# Altium schematic sheet SDRAM RV1126B.SchDoc: LPDDR4 of CPU
size A3; DrawnBy: ThanhQuoc; Revision: V01; SheetNumber: 7; SheetTotal: 21; Project: RV1126 CAMERA BOARD DESIGN
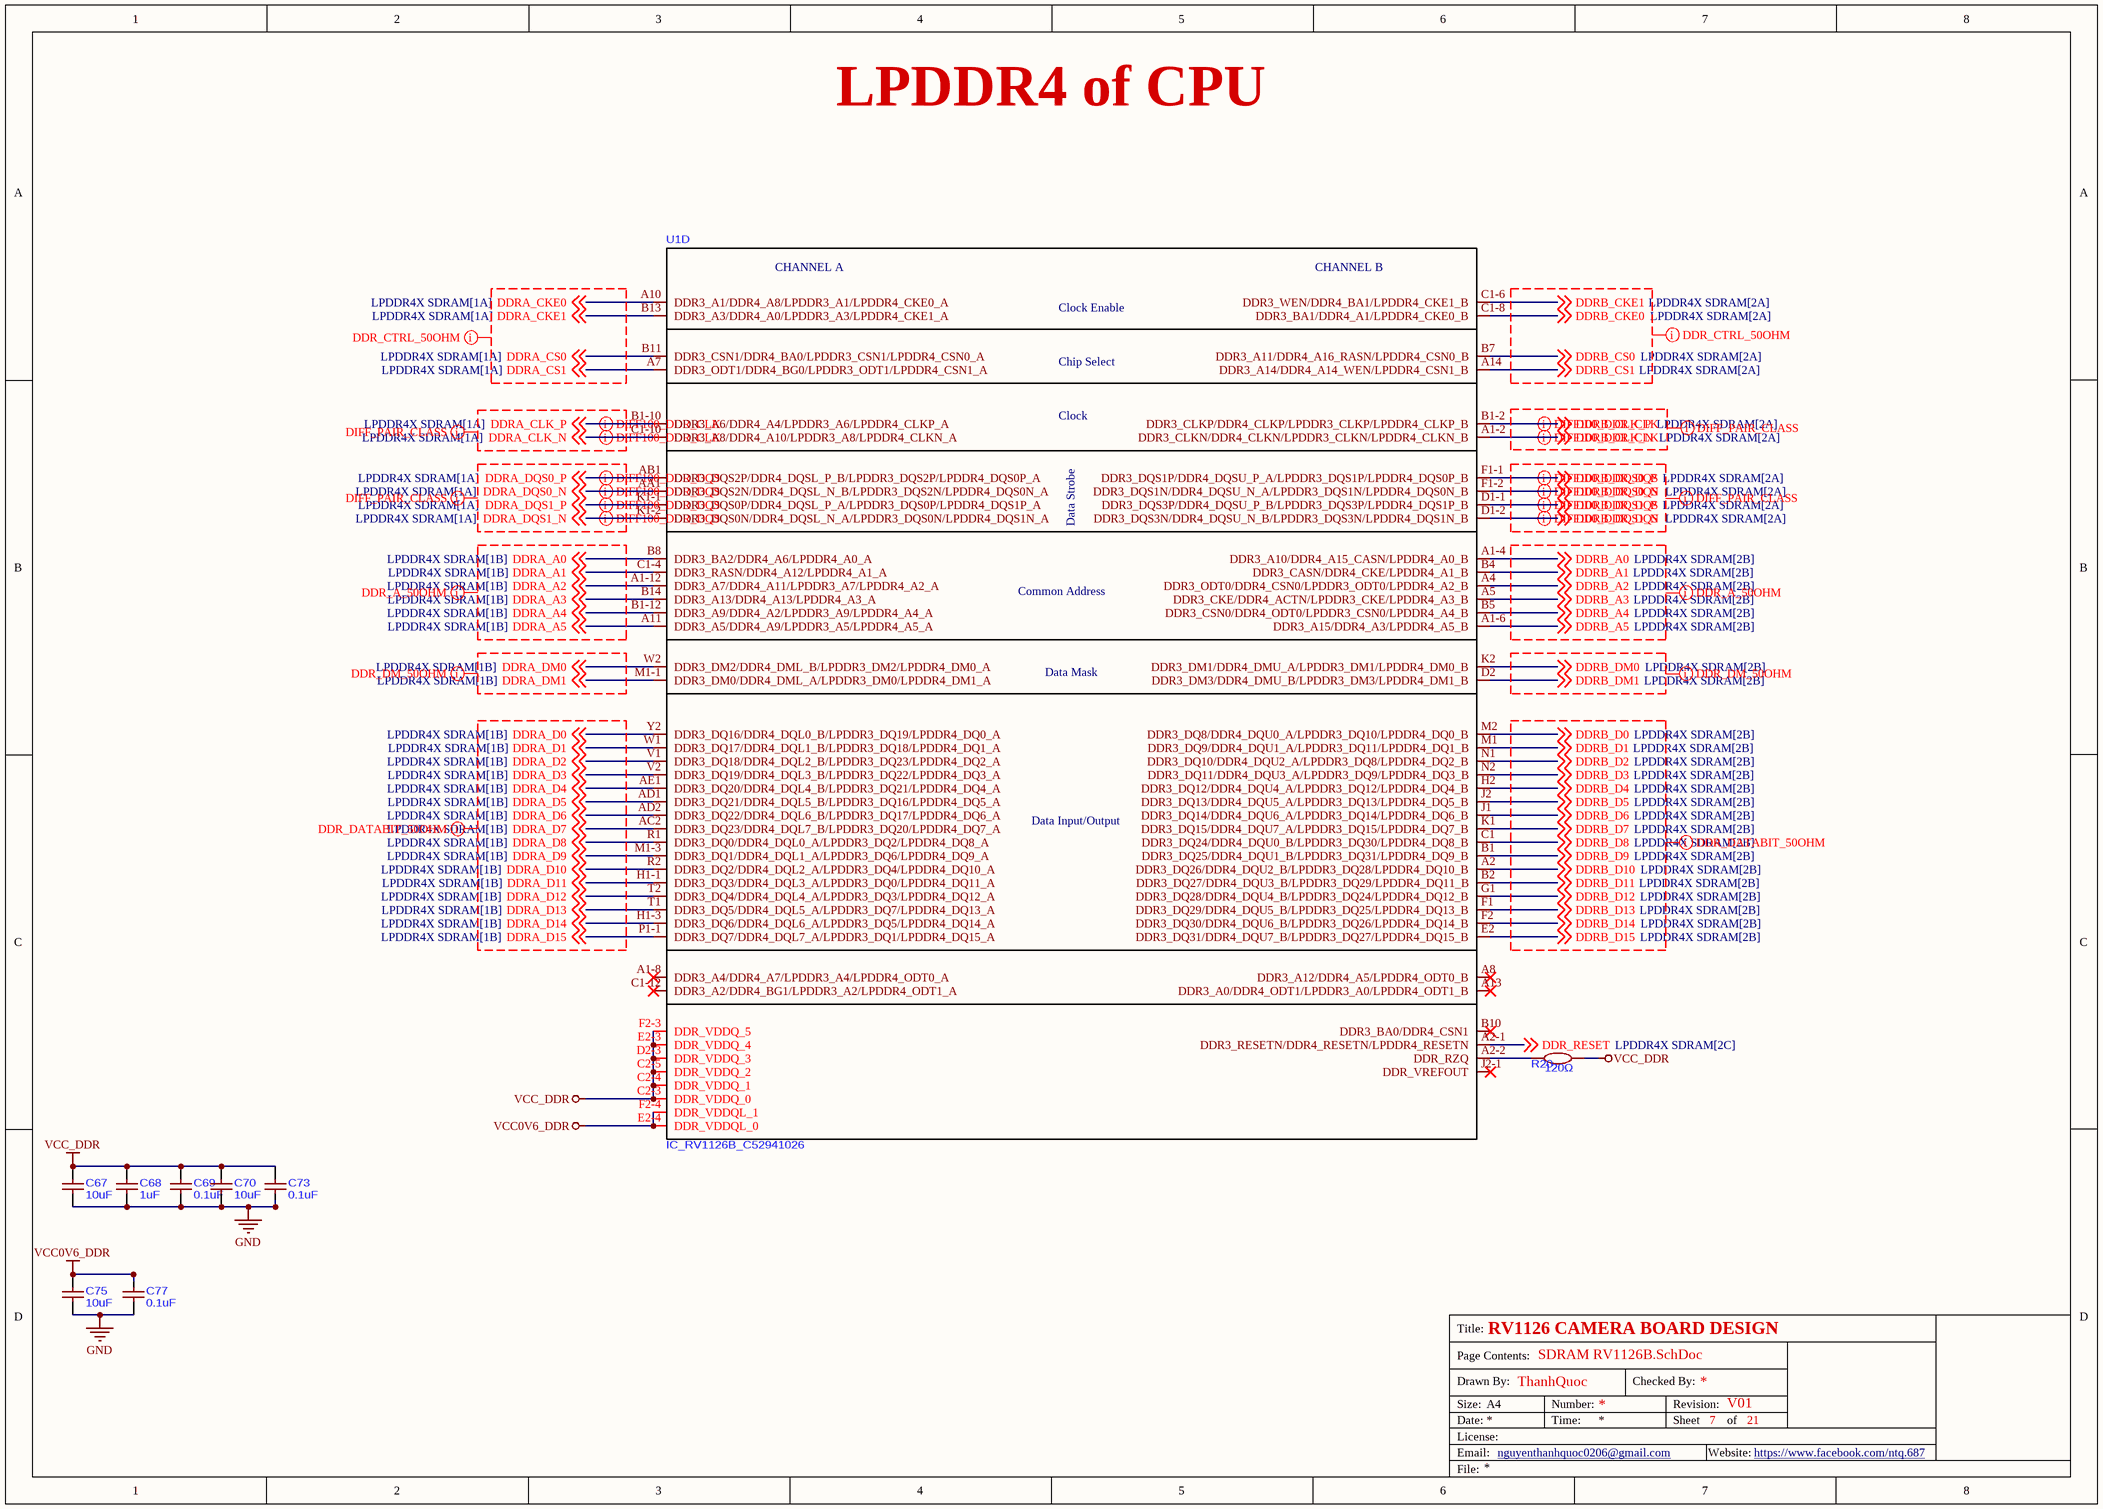
[diagram p0: SDRAM RV1126B.SchDoc]

## Parts
C67  10uF  [C0402]
C68  1uF  [C0201]
C69  0.1uF  [C0201]
C70  10uF  [C0402]
C73  0.1uF  [C0201]
C75  10uF  [C0402]
C77  0.1uF  [C0201]
R20  120Ω  [R0201]
U1  IC_RV1126B_C52941026  [CCSP-491_L14.0-W14.0-TL_RV1126B]  (part D of 18)

## Nets
GND: C67.1 C68.1 C69.1 C70.1 C73.1 C75.1 C77.1
VCC0V6_DDR: C75.2 C77.2 U1.E2-4(DDR_VDDQL_0) U1.F2-4(DDR_VDDQL_1)
VCC_DDR: C67.2 C68.2 C69.2 C70.2 C73.2 R20.1 U1.C2-3(DDR_VDDQ_0) U1.C2-4(DDR_VDDQ_1) U1.C2-5(DDR_VDDQ_2) U1.D2-3(DDR_VDDQ_3) U1.E2-3(DDR_VDDQ_4) U1.F2-3(DDR_VDDQ_5)
DDR_RESET: U1.A2-1(DDR3_RESETN/DDR4_RESETN/LPDDR4_RESETN) ; off-sheet DDR_RESET
DDRA_A0: U1.B8(DDR3_BA2/DDR4_A6/LPDDR4_A0_A) ; off-sheet DDRA_A0
DDRA_A1: U1.C1-4(DDR3_RASN/DDR4_A12/LPDDR4_A1_A) ; off-sheet DDRA_A1
DDRA_A2: U1.A1-12(DDR3_A7/DDR4_A11/LPDDR3_A7/LPDDR4_A2_A) ; off-sheet DDRA_A2
DDRA_A3: U1.B14(DDR3_A13/DDR4_A13/LPDDR4_A3_A) ; off-sheet DDRA_A3
DDRA_A4: U1.B1-12(DDR3_A9/DDR4_A2/LPDDR3_A9/LPDDR4_A4_A) ; off-sheet DDRA_A4
DDRA_A5: U1.A11(DDR3_A5/DDR4_A9/LPDDR3_A5/LPDDR4_A5_A) ; off-sheet DDRA_A5
DDRA_CKE0: U1.A10(DDR3_A1/DDR4_A8/LPDDR3_A1/LPDDR4_CKE0_A) ; off-sheet DDRA_CKE0
DDRA_CKE1: U1.B13(DDR3_A3/DDR4_A0/LPDDR3_A3/LPDDR4_CKE1_A) ; off-sheet DDRA_CKE1
DDRA_CLK_N: U1.C1-10(DDR3_A8/DDR4_A10/LPDDR3_A8/LPDDR4_CLKN_A) ; off-sheet DDRA_CLK_N
DDRA_CLK_P: U1.B1-10(DDR3_A6/DDR4_A4/LPDDR3_A6/LPDDR4_CLKP_A) ; off-sheet DDRA_CLK_P
DDRA_CS0: U1.B11(DDR3_CSN1/DDR4_BA0/LPDDR3_CSN1/LPDDR4_CSN0_A) ; off-sheet DDRA_CS0
DDRA_CS1: U1.A7(DDR3_ODT1/DDR4_BG0/LPDDR3_ODT1/LPDDR4_CSN1_A) ; off-sheet DDRA_CS1
DDRA_D0: U1.Y2(DDR3_DQ16/DDR4_DQL0_B/LPDDR3_DQ19/LPDDR4_DQ0_A) ; off-sheet DDRA_D0
DDRA_D1: U1.W1(DDR3_DQ17/DDR4_DQL1_B/LPDDR3_DQ18/LPDDR4_DQ1_A) ; off-sheet DDRA_D1
DDRA_D2: U1.V1(DDR3_DQ18/DDR4_DQL2_B/LPDDR3_DQ23/LPDDR4_DQ2_A) ; off-sheet DDRA_D2
DDRA_D3: U1.V2(DDR3_DQ19/DDR4_DQL3_B/LPDDR3_DQ22/LPDDR4_DQ3_A) ; off-sheet DDRA_D3
DDRA_D4: U1.AE1(DDR3_DQ20/DDR4_DQL4_B/LPDDR3_DQ21/LPDDR4_DQ4_A) ; off-sheet DDRA_D4
DDRA_D5: U1.AD1(DDR3_DQ21/DDR4_DQL5_B/LPDDR3_DQ16/LPDDR4_DQ5_A) ; off-sheet DDRA_D5
DDRA_D6: U1.AD2(DDR3_DQ22/DDR4_DQL6_B/LPDDR3_DQ17/LPDDR4_DQ6_A) ; off-sheet DDRA_D6
DDRA_D7: U1.AC2(DDR3_DQ23/DDR4_DQL7_B/LPDDR3_DQ20/LPDDR4_DQ7_A) ; off-sheet DDRA_D7
DDRA_D8: U1.R1(DDR3_DQ0/DDR4_DQL0_A/LPDDR3_DQ2/LPDDR4_DQ8_A) ; off-sheet DDRA_D8
DDRA_D9: U1.M1-3(DDR3_DQ1/DDR4_DQL1_A/LPDDR3_DQ6/LPDDR4_DQ9_A) ; off-sheet DDRA_D9
DDRA_D10: U1.R2(DDR3_DQ2/DDR4_DQL2_A/LPDDR3_DQ4/LPDDR4_DQ10_A) ; off-sheet DDRA_D10
DDRA_D11: U1.H1-1(DDR3_DQ3/DDR4_DQL3_A/LPDDR3_DQ0/LPDDR4_DQ11_A) ; off-sheet DDRA_D11
DDRA_D12: U1.T2(DDR3_DQ4/DDR4_DQL4_A/LPDDR3_DQ3/LPDDR4_DQ12_A) ; off-sheet DDRA_D12
DDRA_D13: U1.T1(DDR3_DQ5/DDR4_DQL5_A/LPDDR3_DQ7/LPDDR4_DQ13_A) ; off-sheet DDRA_D13
DDRA_D14: U1.H1-3(DDR3_DQ6/DDR4_DQL6_A/LPDDR3_DQ5/LPDDR4_DQ14_A) ; off-sheet DDRA_D14
DDRA_D15: U1.P1-1(DDR3_DQ7/DDR4_DQL7_A/LPDDR3_DQ1/LPDDR4_DQ15_A) ; off-sheet DDRA_D15
DDRA_DM0: U1.W2(DDR3_DM2/DDR4_DML_B/LPDDR3_DM2/LPDDR4_DM0_A) ; off-sheet DDRA_DM0
DDRA_DM1: U1.M1-1(DDR3_DM0/DDR4_DML_A/LPDDR3_DM0/LPDDR4_DM1_A) ; off-sheet DDRA_DM1
DDRA_DQS0_N: U1.AA1(DDR3_DQS2N/DDR4_DQSL_N_B/LPDDR3_DQS2N/LPDDR4_DQS0N_A) ; off-sheet DDRA_DQS0_N
DDRA_DQS0_P: U1.AB1(DDR3_DQS2P/DDR4_DQSL_P_B/LPDDR3_DQS2P/LPDDR4_DQS0P_A) ; off-sheet DDRA_DQS0_P
DDRA_DQS1_N: U1.K1-2(DDR3_DQS0N/DDR4_DQSL_N_A/LPDDR3_DQS0N/LPDDR4_DQS1N_A) ; off-sheet DDRA_DQS1_N
DDRA_DQS1_P: U1.K1-1(DDR3_DQS0P/DDR4_DQSL_P_A/LPDDR3_DQS0P/LPDDR4_DQS1P_A) ; off-sheet DDRA_DQS1_P
DDRB_A0: U1.A1-4(DDR3_A10/DDR4_A15_CASN/LPDDR4_A0_B) ; off-sheet DDRB_A0
DDRB_A1: U1.B4(DDR3_CASN/DDR4_CKE/LPDDR4_A1_B) ; off-sheet DDRB_A1
DDRB_A2: U1.A4(DDR3_ODT0/DDR4_CSN0/LPDDR3_ODT0/LPDDR4_A2_B) ; off-sheet DDRB_A2
DDRB_A3: U1.A5(DDR3_CKE/DDR4_ACTN/LPDDR3_CKE/LPDDR4_A3_B) ; off-sheet DDRB_A3
DDRB_A4: U1.B5(DDR3_CSN0/DDR4_ODT0/LPDDR3_CSN0/LPDDR4_A4_B) ; off-sheet DDRB_A4
DDRB_A5: U1.A1-6(DDR3_A15/DDR4_A3/LPDDR4_A5_B) ; off-sheet DDRB_A5
DDRB_CKE0: U1.C1-8(DDR3_BA1/DDR4_A1/LPDDR4_CKE0_B) ; off-sheet DDRB_CKE0
DDRB_CKE1: U1.C1-6(DDR3_WEN/DDR4_BA1/LPDDR4_CKE1_B) ; off-sheet DDRB_CKE1
DDRB_CLK_N: U1.A1-2(DDR3_CLKN/DDR4_CLKN/LPDDR3_CLKN/LPDDR4_CLKN_B) ; off-sheet DDRB_CLK_N
DDRB_CLK_P: U1.B1-2(DDR3_CLKP/DDR4_CLKP/LPDDR3_CLKP/LPDDR4_CLKP_B) ; off-sheet DDRB_CLK_P
DDRB_CS0: U1.B7(DDR3_A11/DDR4_A16_RASN/LPDDR4_CSN0_B) ; off-sheet DDRB_CS0
DDRB_CS1: U1.A14(DDR3_A14/DDR4_A14_WEN/LPDDR4_CSN1_B) ; off-sheet DDRB_CS1
DDRB_D0: U1.M2(DDR3_DQ8/DDR4_DQU0_A/LPDDR3_DQ10/LPDDR4_DQ0_B) ; off-sheet DDRB_D0
DDRB_D1: U1.M1(DDR3_DQ9/DDR4_DQU1_A/LPDDR3_DQ11/LPDDR4_DQ1_B) ; off-sheet DDRB_D1
DDRB_D2: U1.N1(DDR3_DQ10/DDR4_DQU2_A/LPDDR3_DQ8/LPDDR4_DQ2_B) ; off-sheet DDRB_D2
DDRB_D3: U1.N2(DDR3_DQ11/DDR4_DQU3_A/LPDDR3_DQ9/LPDDR4_DQ3_B) ; off-sheet DDRB_D3
DDRB_D4: U1.H2(DDR3_DQ12/DDR4_DQU4_A/LPDDR3_DQ12/LPDDR4_DQ4_B) ; off-sheet DDRB_D4
DDRB_D5: U1.J2(DDR3_DQ13/DDR4_DQU5_A/LPDDR3_DQ13/LPDDR4_DQ5_B) ; off-sheet DDRB_D5
DDRB_D6: U1.J1(DDR3_DQ14/DDR4_DQU6_A/LPDDR3_DQ14/LPDDR4_DQ6_B) ; off-sheet DDRB_D6
DDRB_D7: U1.K1(DDR3_DQ15/DDR4_DQU7_A/LPDDR3_DQ15/LPDDR4_DQ7_B) ; off-sheet DDRB_D7
DDRB_D8: U1.C1(DDR3_DQ24/DDR4_DQU0_B/LPDDR3_DQ30/LPDDR4_DQ8_B) ; off-sheet DDRB_D8
DDRB_D9: U1.B1(DDR3_DQ25/DDR4_DQU1_B/LPDDR3_DQ31/LPDDR4_DQ9_B) ; off-sheet DDRB_D9
DDRB_D10: U1.A2(DDR3_DQ26/DDR4_DQU2_B/LPDDR3_DQ28/LPDDR4_DQ10_B) ; off-sheet DDRB_D10
DDRB_D11: U1.B2(DDR3_DQ27/DDR4_DQU3_B/LPDDR3_DQ29/LPDDR4_DQ11_B) ; off-sheet DDRB_D11
DDRB_D12: U1.G1(DDR3_DQ28/DDR4_DQU4_B/LPDDR3_DQ24/LPDDR4_DQ12_B) ; off-sheet DDRB_D12
DDRB_D13: U1.F1(DDR3_DQ29/DDR4_DQU5_B/LPDDR3_DQ25/LPDDR4_DQ13_B) ; off-sheet DDRB_D13
DDRB_D14: U1.F2(DDR3_DQ30/DDR4_DQU6_B/LPDDR3_DQ26/LPDDR4_DQ14_B) ; off-sheet DDRB_D14
DDRB_D15: U1.E2(DDR3_DQ31/DDR4_DQU7_B/LPDDR3_DQ27/LPDDR4_DQ15_B) ; off-sheet DDRB_D15
DDRB_DM0: U1.K2(DDR3_DM1/DDR4_DMU_A/LPDDR3_DM1/LPDDR4_DM0_B) ; off-sheet DDRB_DM0
DDRB_DM1: U1.D2(DDR3_DM3/DDR4_DMU_B/LPDDR3_DM3/LPDDR4_DM1_B) ; off-sheet DDRB_DM1
DDRB_DQS0_N: U1.F1-2(DDR3_DQS1N/DDR4_DQSU_N_A/LPDDR3_DQS1N/LPDDR4_DQS0N_B) ; off-sheet DDRB_DQS0_N
DDRB_DQS0_P: U1.F1-1(DDR3_DQS1P/DDR4_DQSU_P_A/LPDDR3_DQS1P/LPDDR4_DQS0P_B) ; off-sheet DDRB_DQS0_P
DDRB_DQS1_N: U1.D1-2(DDR3_DQS3N/DDR4_DQSU_N_B/LPDDR3_DQS3N/LPDDR4_DQS1N_B) ; off-sheet DDRB_DQS1_N
DDRB_DQS1_P: U1.D1-1(DDR3_DQS3P/DDR4_DQSU_P_B/LPDDR3_DQS3P/LPDDR4_DQS1P_B) ; off-sheet DDRB_DQS1_P
NetR20_2: R20.2 U1.A2-2(DDR_RZQ)

Not connected (* = marked no-connect by the designer): U1 A1-8(DDR3_A4/DDR4_A7/LPDDR3_A4/LPDDR4_ODT0_A)* A8(DDR3_A12/DDR4_A5/LPDDR4_ODT0_B)* A13(DDR3_A0/DDR4_ODT1/LPDDR3_A0/LPDDR4_ODT1_B)* B10(DDR3_BA0/DDR4_CSN1)* C1-12(DDR3_A2/DDR4_BG1/LPDDR3_A2/LPDDR4_ODT1_A)* J2-1(DDR_VREFOUT)*

## Layout directives
net class DIFF_PAIR_CLASS: DDRA_CLK_N, DDRA_CLK_P, DDRA_DQS0_N, DDRA_DQS0_P, DDRA_DQS1_N, DDRA_DQS1_P, DDRB_CLK_N, DDRB_CLK_P, DDRB_DQS0_N, DDRB_DQS0_P, DDRB_DQS1_N, DDRB_DQS1_P
differential pair; differential pair class DIFF100_DDR_CLK: DDRA_CLK_N, DDRA_CLK_P, DDRB_CLK_N, DDRB_CLK_P
differential pair; differential pair class DIFF100_DDR_DQS: DDRA_DQS0_N, DDRA_DQS0_P, DDRA_DQS1_N, DDRA_DQS1_P, DDRB_DQS0_N, DDRB_DQS0_P, DDRB_DQS1_N, DDRB_DQS1_P
net class DDR_CTRL_50OHM: DDRA_CKE0, DDRA_CKE1, DDRA_CS0, DDRA_CS1, DDRB_CKE0, DDRB_CKE1, DDRB_CS0, DDRB_CS1
net class DDR_A_50OHM: DDRA_A0, DDRA_A1, DDRA_A2, DDRA_A3, DDRA_A4, DDRA_A5, DDRB_A0, DDRB_A1, DDRB_A2, DDRB_A3, DDRB_A4, DDRB_A5
net class DDR_DATABIT_50OHM: DDRA_D0, DDRA_D1, DDRA_D2, DDRA_D3, DDRA_D4, DDRA_D5, DDRA_D6, DDRA_D7, DDRA_D8, DDRA_D9, DDRA_D10, DDRA_D11, DDRA_D12, DDRA_D13, DDRA_D14, DDRA_D15, DDRB_D0, DDRB_D1, DDRB_D2, DDRB_D3, DDRB_D4, DDRB_D5, DDRB_D6, DDRB_D7, DDRB_D8, DDRB_D9, DDRB_D10, DDRB_D11, DDRB_D12, DDRB_D13, DDRB_D14, DDRB_D15
net class DDR_DM_50OHM: DDRA_DM0, DDRA_DM1, DDRB_DM0, DDRB_DM1

## Notes on the sheet
- Title:
- Drawn By:
- Page Contents:
- Checked By:
- Size:
- Date:
- File:
- License:
- Email:
- A4
- nguyenthanhquoc0206@gmail.com <=E-Mail>
- Number:
- Time:
- Revision:
- Sheet
- Website:
- of
- https://www.facebook.com/ntq.687
- (in symbol IC_RV1126B_C52941026, part D) CHANNEL A; CHANNEL B; Clock Enable; Chip Select; Clock; Data Strobe; Common Address; Data Mask; Data Input/Output

## Library data of the parts
C67 C70 C75 = CAP_10uF-10V-20%-0402: 10µF ±20% 10V Ceramic Capacitor X5R 0402 (1005 Metric)
C68 = CAP_1uF-6.3V-10%-0201: 1uF ±10% 6.3V Ceramic Capacitor X5R 0201
C69 C73 C77 = CAP_100nF-6.3V-10%-0201_1: 0.1uF ±10% 6.3V Ceramic Capacitor X5R 0201
R20 = RES_120-50mW-1%-0201: RES 120Ω ±1% 50mW 0201; ComponentLink1Description: LCSC; ComponentLink1URL: https://www.lcsc.com/product-detail/C295718.html?s_z=n_q_t_120%2520OHM&spm=wm.fly.bg.5.xh___wm.ssy.tc.1.tz&lcsc_vid=EwRWBFZSQVIPVFdUTlJfVldeFFRYUFQAElRYBFRRE1MxVlNeRFZeU1BfTlBYVzsOAxUeFF5JWBYZEEoKFBINSQcJGk4eFQsCAgIaSgADAwAHC0slRVhcV1ZTT08GEwkK